# EAGLE schematic TSC8-75 (EAGLE 6.6.0)

## Sheet 1 of 4
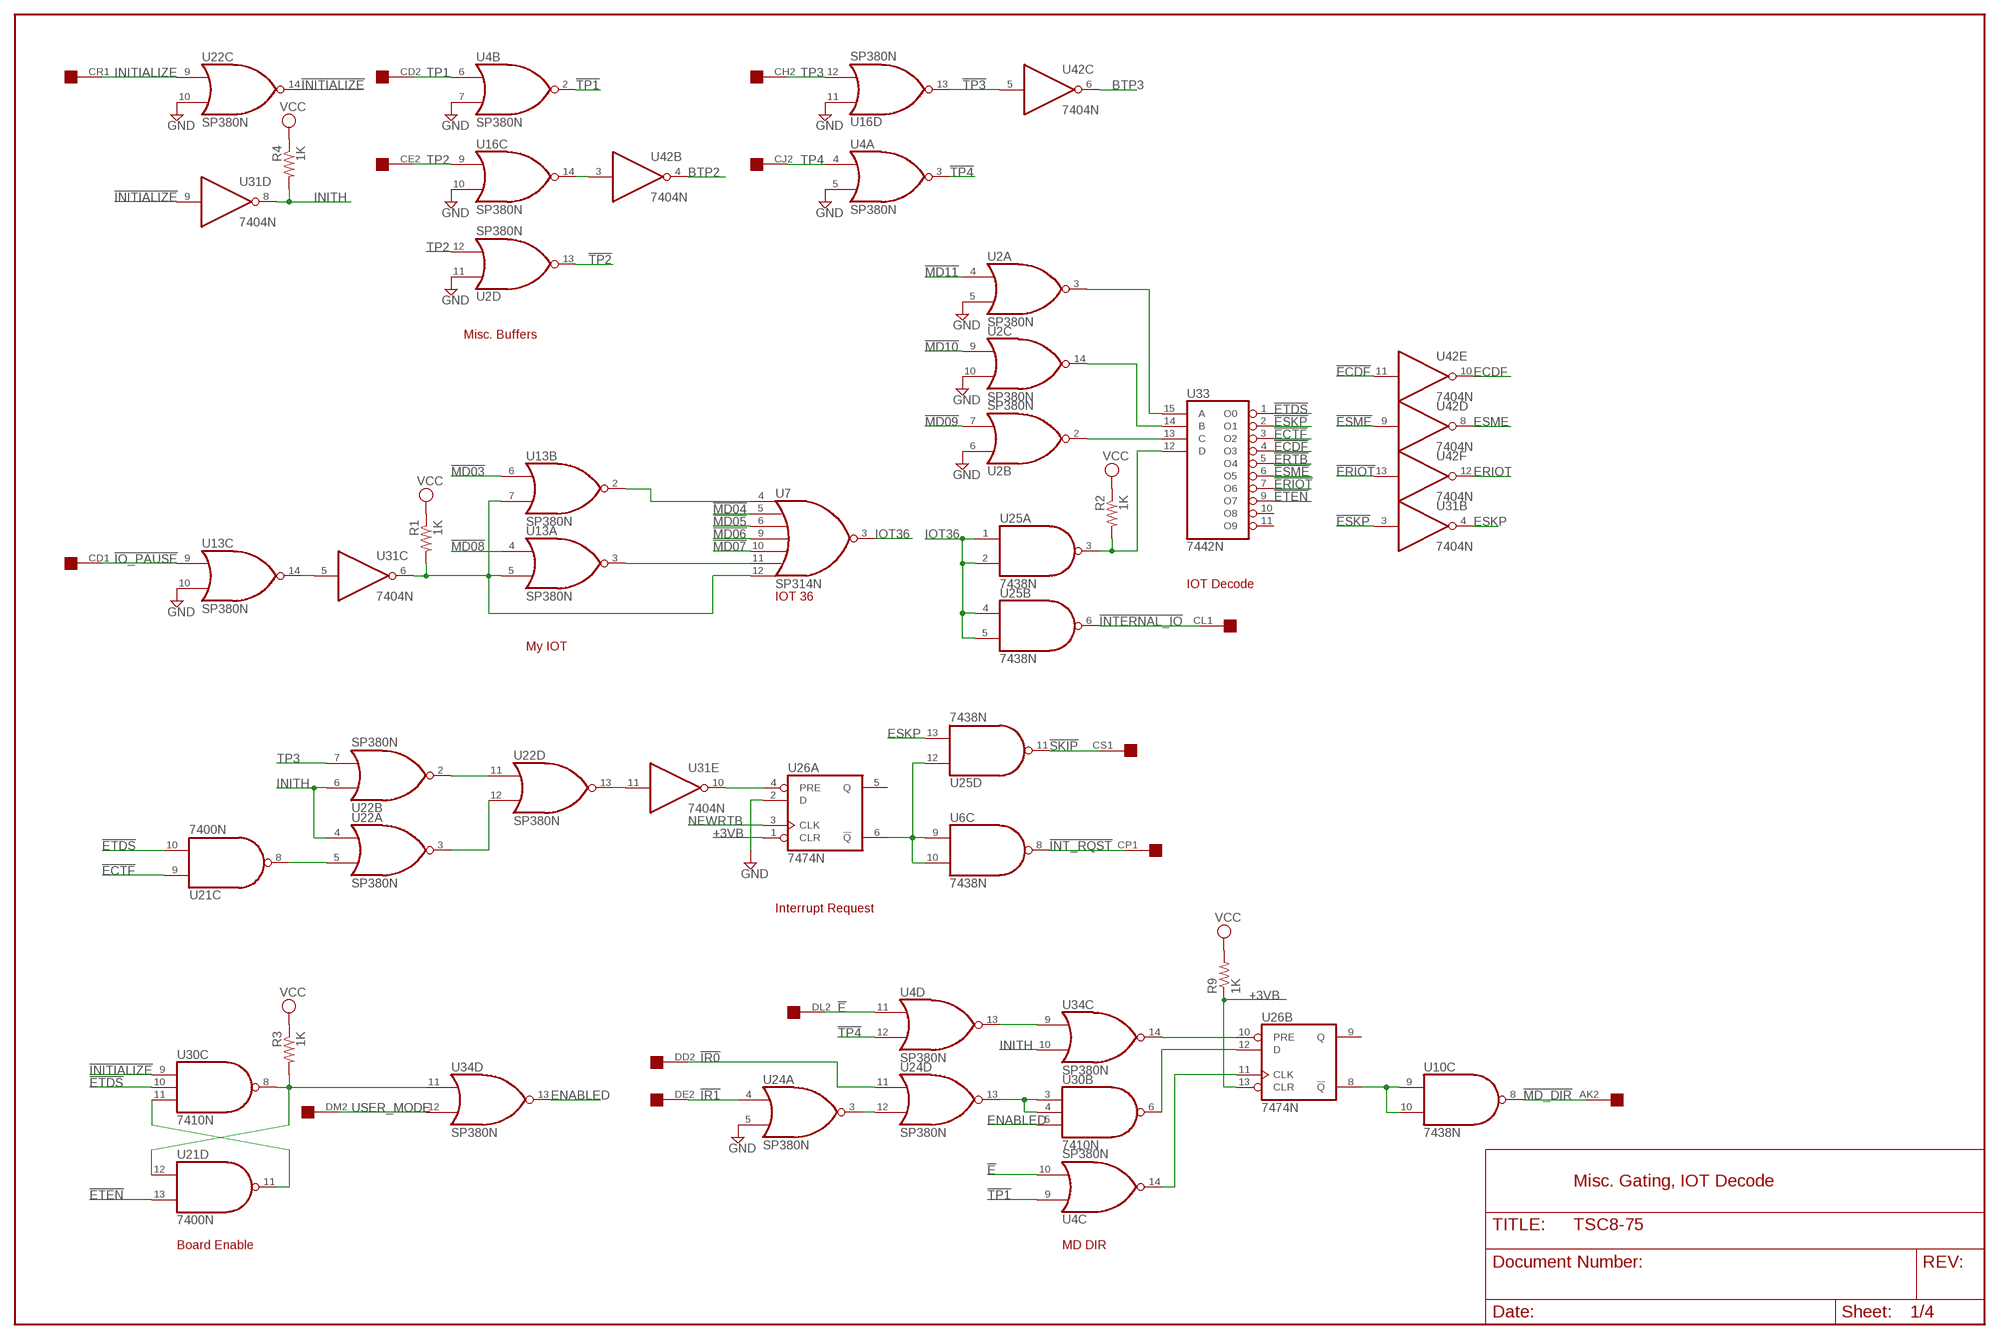
[diagram p0: schematic, sheet 1]

### Parts
EDGE  edge  QUAD  [EDGE-CON8]
R1  1K  R-US_0204/7  [0204/7]
R2  1K  R-US_0204/7  [0204/7]
R3  1K  R-US_0204/7  [0204/7]
R4  1K  R-US_0204/7  [0204/7]
R9  1K  R-US_0204/7  [0204/7]
U2  SP380N  [DIL14]
U4  SP380N  [DIL14]
U6  7438N  [DIL14]
U7  SP314N  [DIL14]
U10  7438N  [DIL14]
U13  SP380N  [DIL14]
U16  SP380N  [DIL14]
U21  7400N  [DIL14]
U22  SP380N  [DIL14]
U24  SP380N  [DIL14]
U25  7438N  [DIL14]
U26  7474N  74S74N  [DIL14]
U30  7410N  [DIL14]
U31  7404N  [DIL14]
U33  7442N  74LS42N  [DIL16]
U34  SP380N  [DIL14]
U42  7404N  [DIL14]

### Nets
!E: EDGE.DL2 U4.10(C:I1) U4.11(D:I0)
!ECDF: U33.4(O3) U42.11(E:I)
!ECTF: U21.9(C:I0) U33.3(O2)
!ERIOT: U33.7(O6) U42.13(F:I) ; also sheet 3
!ERTB: U33.5(O4) ; also sheet 3
!ESKP: U31.3(B:I) U33.2(O1)
!ESME: U33.6(O5) U42.9(D:I)
!ETDS: U21.10(C:I1) U30.10(C:I1) U33.1(O0) ; also sheet 4
!ETEN: U21.13(D:I1) U33.9(O7)
!INITIALIZE: U22.14(C:O) U30.9(C:I0) U31.9(D:I) ; also sheet 2,4
!INT_RQST: EDGE.CP1 U6.8(C:O)
!INTERNAL_IO: EDGE.CL1 U25.6(B:O)
!IO_PAUSE: EDGE.CD1 U13.9(C:I0)
!IR0: EDGE.DD2 U24.11(D:I0)
!IR1: EDGE.DE2 U24.4(A:I0)
!MD03: U13.6(B:I0) ; also sheet 2
!MD04: U7.5(I1) ; also sheet 2
!MD05: U7.6(I2) ; also sheet 2
!MD06: U7.9(I3) ; also sheet 2
!MD07: U7.10(I4) ; also sheet 2
!MD08: U13.4(A:I0) ; also sheet 2
!MD09: U2.7(B:I1) ; also sheet 2
!MD10: U2.9(C:I0) ; also sheet 2
!MD11: U2.4(A:I0) ; also sheet 2
!MD_DIR: EDGE.AK2 U10.8(C:O)
!SKIP: EDGE.CS1 U25.11(D:O) ; also sheet 4
!TP1: U4.2(B:O) U4.9(C:I0)
!TP2: U2.13(D:O) ; also sheet 2
!TP3: U16.13(D:O) U42.5(C:I)
!TP4: U4.3(A:O) U4.12(D:I1)
+3VB: R9.1 U26.1(A:CLR) U26.13(B:CLR) ; also sheet 4
BTP2: U42.4(B:O) ; also sheet 2
BTP3: U42.6(C:O) ; also sheet 4
ECDF: U42.10(E:O) ; also sheet 3,4
ENABLED: U30.5(B:I2) U34.13(D:O) ; also sheet 2
ERIOT: U42.12(F:O) ; also sheet 3
ESKP: U25.13(D:I1) U31.4(B:O)
ESME: U42.8(D:O) ; also sheet 4
GND: U2.5(A:I1) U2.6(B:I0) U2.10(C:I1) U2.11(D:I0) U4.5(A:I1) U4.7(B:I1) U13.10(C:I1) U16.10(C:I1) U16.11(D:I0) U22.10(C:I1) U24.5(A:I1) U26.2(A:D) ; also sheet 2,3,4
INITH: R4.2 U22.4(A:I0) U22.6(B:I0) U31.8(D:O) U34.10(C:I1)
INITIALIZE: EDGE.CR1 U22.9(C:I0)
IO_PAUSE: U13.14(C:O) U31.5(C:I)
IOT36: U7.3(O) U25.1(A:I0) U25.2(A:I1) U25.4(B:I0) U25.5(B:I1)
IR1: U24.3(A:O) U24.12(D:I1)
IRQ: U6.9(C:I0) U6.10(C:I1) U25.12(D:I0) U26.6(A:!Q)
MD09H: U2.2(B:O) U33.13(C)
MD10H: U2.14(C:O) U33.14(B)
MD11H: U2.3(A:O) U33.15(A)
N$21: U16.14(C:O) U42.3(B:I)
N$82: U4.14(C:O) U26.11(B:CLK)
N$91: U26.4(A:PRE) U31.10(E:O)
N$94: U26.12(B:D) U30.6(B:O)
N$97: U26.10(B:PRE) U34.14(C:O)
N$131: U7.4(I0) U13.2(B:O)
N$133: R1.2 U7.12(I6) U13.5(A:I1) U13.7(B:I1) U31.6(C:O)
N$136: U7.11(I5) U13.3(A:O)
N$160: R2.2 U25.3(A:O) U33.12(D)
N$161: R3.2 U21.12(D:I0) U30.8(C:O) U34.11(D:I0)
N$167: U4.13(D:O) U34.9(C:I0)
N$218: U24.13(D:O) U30.3(B:I0) U30.4(B:I1)
N$333: U22.2(B:O) U22.11(D:I0)
N$334: U22.3(A:O) U22.12(D:I1)
N$336: U21.8(C:O) U22.5(A:I1)
N$342: U22.13(D:O) U31.11(E:I)
N$406: U21.11(D:O) U30.11(C:I2)
N$516: U10.9(C:I0) U10.10(C:I1) U26.8(B:!Q)
NEWRTB: U26.3(A:CLK) ; also sheet 2
TP1: EDGE.CD2 U4.6(B:I0)
TP2: EDGE.CE2 U2.12(D:I1) U16.9(C:I0)
TP3: EDGE.CH2 U16.12(D:I1) U22.7(B:I1)
TP4: EDGE.CJ2 U4.4(A:I0)
USER_MODE: EDGE.DM2 U34.12(D:I1) ; also sheet 2
VCC: R1.1 R2.1 R3.1 R4.1 R9.2 ; also sheet 2,3,4
Unconnected: EDGE.AA1 EDGE.AB1 EDGE.AB2 EDGE.AC1 EDGE.AD2 EDGE.AE2 EDGE.AH2 EDGE.AJ2 EDGE.AL2 EDGE.AM2 EDGE.AP2 EDGE.AR2 EDGE.AS2 EDGE.AU2 EDGE.AV2 EDGE.BA1 EDGE.BB1 EDGE.BB2 EDGE.BD2 EDGE.BE2 EDGE.BH2 EDGE.BJ2 EDGE.BK2 EDGE.BL2 EDGE.BM2 EDGE.BP2 EDGE.BR2 EDGE.BS2 EDGE.BU2 EDGE.BV2 EDGE.CA1 EDGE.CB1 EDGE.CB2 EDGE.CJ1 EDGE.CK1 EDGE.CK2 EDGE.CL2 EDGE.CM1 EDGE.CM2 EDGE.CP2 EDGE.CR2 EDGE.CS2 EDGE.CU1 EDGE.CU2 EDGE.CV1 EDGE.CV2 EDGE.DA1 EDGE.DA2 EDGE.DB1 EDGE.DB2 EDGE.DH2 EDGE.DK2 EDGE.DP2 EDGE.DR2 EDGE.DS2 EDGE.DU2 EDGE.DV2 U6.11(D:O) U6.12(D:I0) U6.13(D:I1) U24.9(C:I0) U24.10(C:I1) U24.14(C:O) U26.5(A:Q) U26.9(B:Q) U31.1(A:I) U31.2(A:O) U33.10(O8) U33.11(O9) U34.3(A:O) U34.4(A:I0) U34.5(A:I1)

### Notes on the sheet
- Misc. Buffers
- IOT Decode
- IOT 36
- My IOT
- Interrupt Request
- Misc. Gating, IOT Decode
- Board Enable | MD DIR

## Sheet 2 of 4
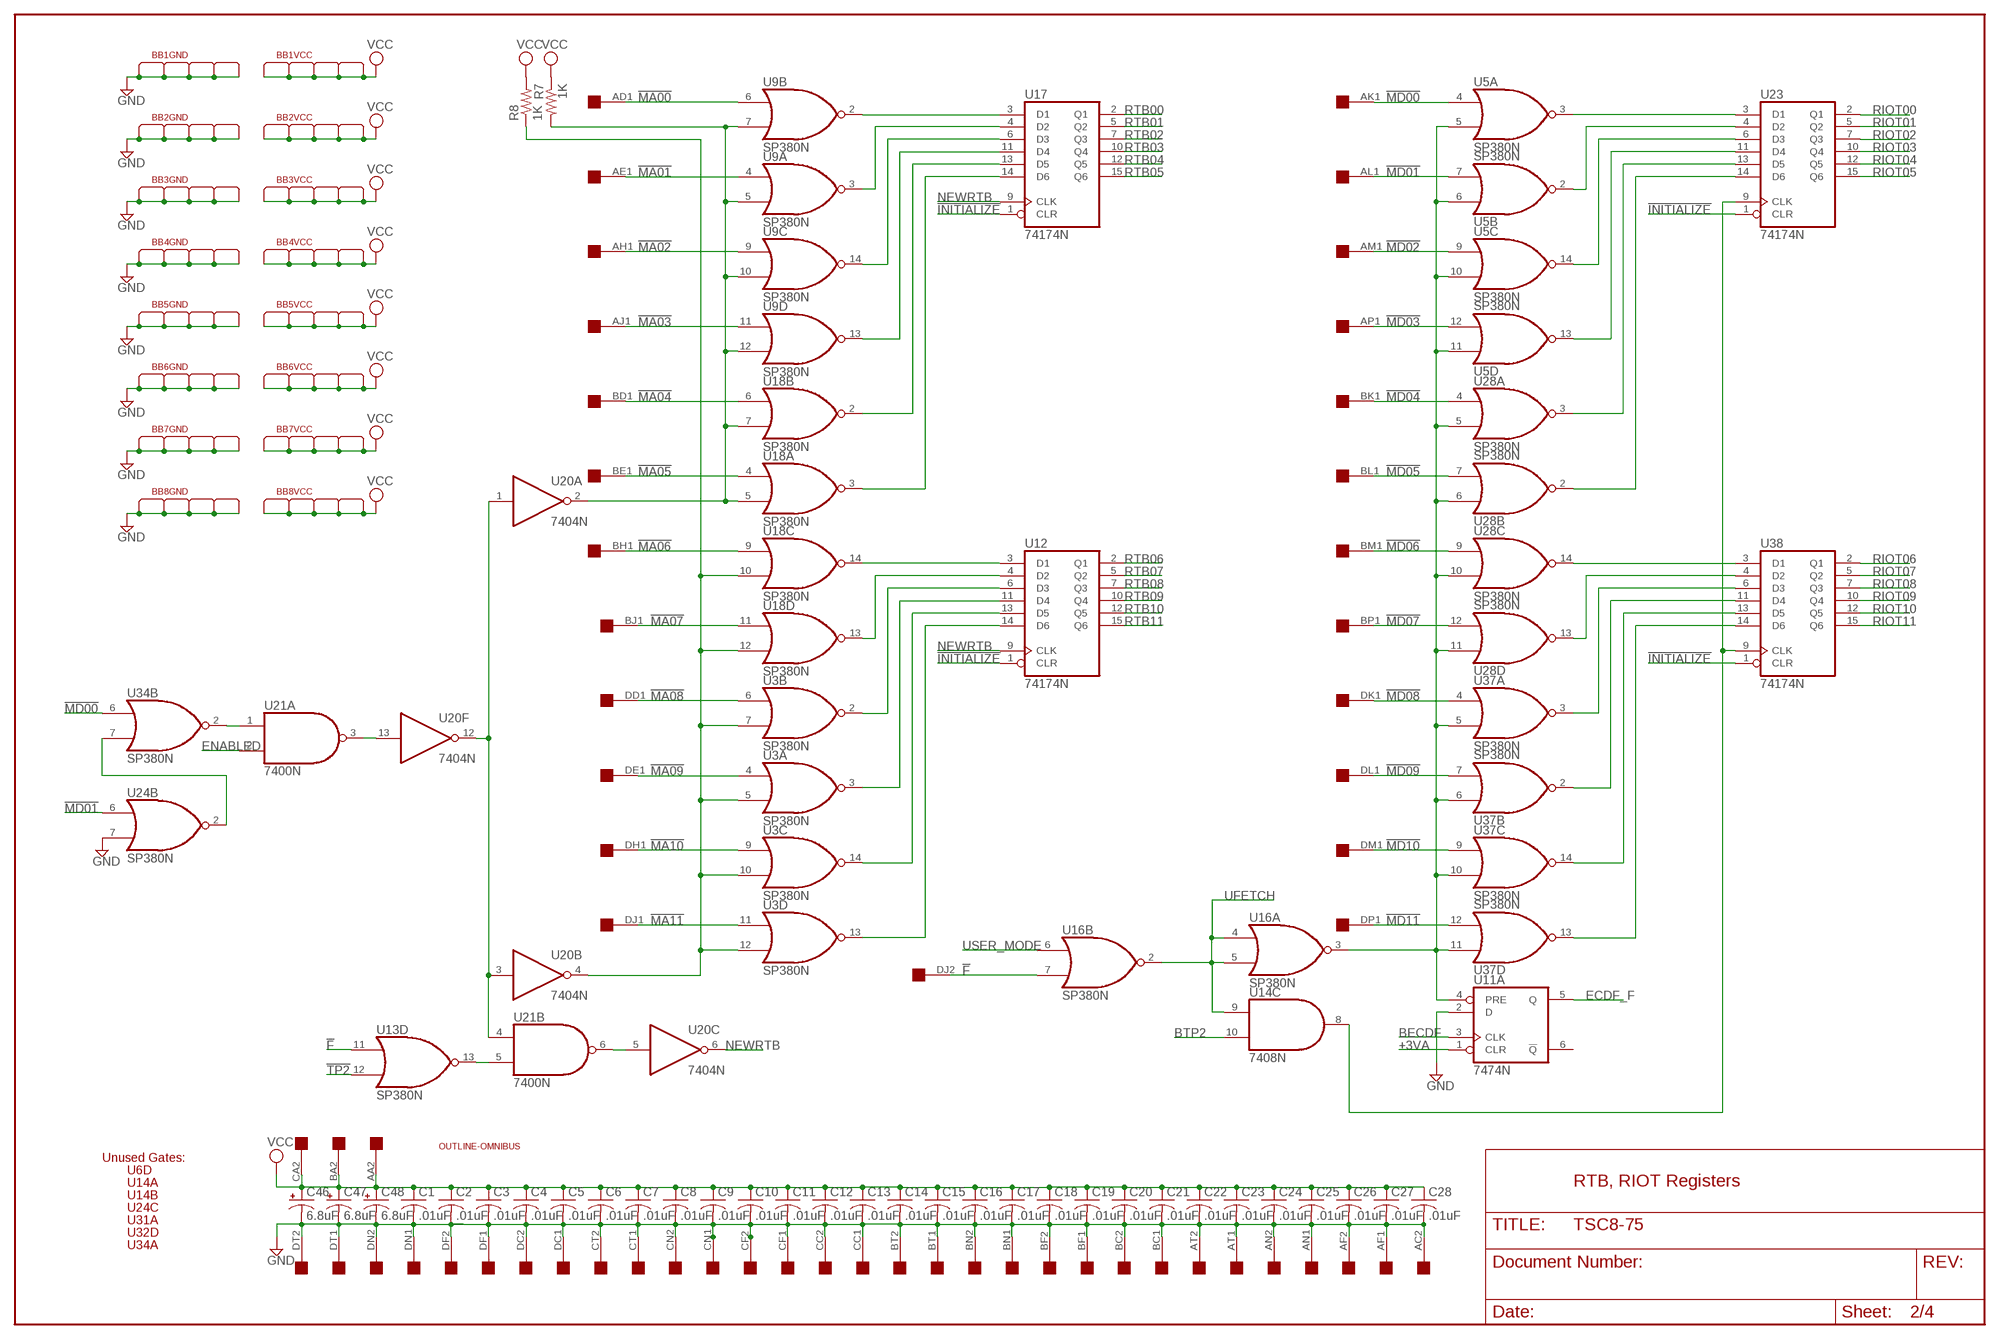
[diagram p1: schematic, sheet 2]

### Parts
BB1  BUSBAR  [BUSBAR]
BB2  BUSBAR  [BUSBAR]
BB3  BUSBAR  [BUSBAR]
BB4  BUSBAR  [BUSBAR]
BB5  BUSBAR  [BUSBAR]
BB6  BUSBAR  [BUSBAR]
BB7  BUSBAR  [BUSBAR]
BB8  BUSBAR  [BUSBAR]
C1  .01uF  C-US050-025X075  [C050-025X075]
C2  .01uF  C-US050-025X075  [C050-025X075]
C3  .01uF  C-US050-025X075  [C050-025X075]
C4  .01uF  C-US050-025X075  [C050-025X075]
C5  .01uF  C-US050-025X075  [C050-025X075]
C6  .01uF  C-US050-025X075  [C050-025X075]
C7  .01uF  C-US050-025X075  [C050-025X075]
C8  .01uF  C-US050-025X075  [C050-025X075]
C9  .01uF  C-US050-025X075  [C050-025X075]
C10  .01uF  C-US050-025X075  [C050-025X075]
C11  .01uF  C-US050-025X075  [C050-025X075]
C12  .01uF  C-US050-025X075  [C050-025X075]
C13  .01uF  C-US050-025X075  [C050-025X075]
C14  .01uF  C-US050-025X075  [C050-025X075]
C15  .01uF  C-US050-025X075  [C050-025X075]
C16  .01uF  C-US050-025X075  [C050-025X075]
C17  .01uF  C-US050-025X075  [C050-025X075]
C18  .01uF  C-US050-025X075  [C050-025X075]
C19  .01uF  C-US050-025X075  [C050-025X075]
C20  .01uF  C-US050-025X075  [C050-025X075]
C21  .01uF  C-US050-025X075  [C050-025X075]
C22  .01uF  C-US050-025X075  [C050-025X075]
C23  .01uF  C-US050-025X075  [C050-025X075]
C24  .01uF  C-US050-025X075  [C050-025X075]
C25  .01uF  C-US050-025X075  [C050-025X075]
C26  .01uF  C-US050-025X075  [C050-025X075]
C27  .01uF  C-US050-025X075  [C050-025X075]
C28  .01uF  C-US050-025X075  [C050-025X075]
C46  6.8uF  CPOL-USE20-8AXIAL  [E12-8]
C47  6.8uF  CPOL-USE20-8AXIAL  [E12-8]
C48  6.8uF  CPOL-USE20-8AXIAL  [E12-8]
R7  1K  R-US_0204/7  [0204/7]
R8  1K  R-US_0204/7  [0204/7]
U3  SP380N  [DIL14]
U5  SP380N  [DIL14]
U9  SP380N  [DIL14]
U11  7474N  74S74N  [DIL14]
U12  74174N  [DIL16]
U14  7408N  74S08N  [DIL14]
U17  74174N  [DIL16]
U18  SP380N  [DIL14]
U20  7404N  [DIL14]
U23  74174N  [DIL16]
U28  SP380N  [DIL14]
U37  SP380N  [DIL14]
U38  74174N  [DIL16]
U$1  OUTLINE-OMNIBUS  [OMNIBUS]

### Nets
!F: EDGE.DJ2 U13.11(D:I0) U16.7(B:I1)
!INITIALIZE: U12.1(CLR) U17.1(CLR) U23.1(CLR) U38.1(CLR) ; also sheet 1,4
!MA00: EDGE.AD1 U9.6(B:I0)
!MA01: EDGE.AE1 U9.4(A:I0)
!MA02: EDGE.AH1 U9.9(C:I0)
!MA03: EDGE.AJ1 U9.11(D:I0)
!MA04: EDGE.BD1 U18.6(B:I0)
!MA05: EDGE.BE1 U18.4(A:I0)
!MA06: EDGE.BH1 U18.9(C:I0)
!MA07: EDGE.BJ1 U18.11(D:I0)
!MA08: EDGE.DD1 U3.6(B:I0)
!MA09: EDGE.DE1 U3.4(A:I0)
!MA10: EDGE.DH1 U3.9(C:I0)
!MA11: EDGE.DJ1 U3.11(D:I0)
!MD00: EDGE.AK1 U5.4(A:I0) U34.6(B:I0)
!MD01: EDGE.AL1 U5.7(B:I1) U24.6(B:I0)
!MD02: EDGE.AM1 U5.9(C:I0)
!MD03: EDGE.AP1 U5.12(D:I1) ; also sheet 1
!MD04: EDGE.BK1 U28.4(A:I0) ; also sheet 1
!MD05: EDGE.BL1 U28.7(B:I1) ; also sheet 1
!MD06: EDGE.BM1 U28.9(C:I0) ; also sheet 1
!MD07: EDGE.BP1 U28.12(D:I1) ; also sheet 1
!MD08: EDGE.DK1 U37.4(A:I0) ; also sheet 1
!MD09: EDGE.DL1 U37.7(B:I1) ; also sheet 1
!MD10: EDGE.DM1 U37.9(C:I0) ; also sheet 1
!MD11: EDGE.DP1 U37.12(D:I1) ; also sheet 1
!TP2: U13.12(D:I1) ; also sheet 1
+3VA: U11.1(A:CLR) ; also sheet 4
BECDF: U11.3(A:CLK) ; also sheet 3
BTP2: U14.10(C:I1) ; also sheet 1
ECDF_F: U11.5(A:Q) ; also sheet 4
ENABLED: U21.2(A:I1) ; also sheet 1
GND: BB1.GND1 BB1.GND2 BB1.GND3 BB1.GND4 BB1.GND5 BB2.GND1 BB2.GND2 BB2.GND3 BB2.GND4 BB2.GND5 BB3.GND1 BB3.GND2 BB3.GND3 BB3.GND4 BB3.GND5 BB4.GND1 BB4.GND2 BB4.GND3 BB4.GND4 BB4.GND5 BB5.GND1 BB5.GND2 BB5.GND3 BB5.GND4 BB5.GND5 BB6.GND1 BB6.GND2 BB6.GND3 BB6.GND4 BB6.GND5 BB7.GND1 BB7.GND2 BB7.GND3 BB7.GND4 BB7.GND5 BB8.GND1 BB8.GND2 BB8.GND3 BB8.GND4 BB8.GND5 C1.2 C2.2 C3.2 C4.2 C5.2 C6.2 C7.2 C8.2 C9.2 C10.2 C11.2 C12.2 C13.2 C14.2 C15.2 C16.2 C17.2 C18.2 C19.2 C20.2 C21.2 C22.2 C23.2 C24.2 C25.2 C26.2 C27.2 C28.2 C46.- C47.- C48.- EDGE.AC2 EDGE.AF1 EDGE.AF2 EDGE.AN1 EDGE.AN2 EDGE.AT1 EDGE.AT2 EDGE.BC1 EDGE.BC2 EDGE.BF1 EDGE.BF2 EDGE.BN1 EDGE.BN2 EDGE.BT1 EDGE.BT2 EDGE.CC1 EDGE.CC2 EDGE.CF1 EDGE.CF2 EDGE.CN1 EDGE.CN2 EDGE.CT1 EDGE.CT2 EDGE.DC1 EDGE.DC2 EDGE.DF1 EDGE.DF2 EDGE.DN1 EDGE.DN2 EDGE.DT1 EDGE.DT2 U11.2(A:D) U24.7(B:I1) ; also sheet 1,3,4
MD01H: U24.2(B:O) U34.7(B:I1)
N$1: U20.5(C:I) U21.6(B:O)
N$2: U9.3(A:O) U17.4(D2)
N$4: R7.2 U9.5(A:I1) U9.7(B:I1) U9.10(C:I1) U9.12(D:I1) U18.5(A:I1) U18.7(B:I1) U20.2(A:O)
N$10: U9.13(D:O) U17.11(D4)
N$11: U9.14(C:O) U17.6(D3)
N$12: U9.2(B:O) U17.3(D1)
N$14: U17.13(D5) U18.2(B:O)
N$20: R8.1 U3.5(A:I1) U3.7(B:I1) U3.10(C:I1) U3.12(D:I1) U18.10(C:I1) U18.12(D:I1) U20.4(B:O)
N$22: U12.4(D2) U18.13(D:O)
N$23: U12.3(D1) U18.14(C:O)
N$24: U17.14(D6) U18.3(A:O)
N$109: U37.3(A:O) U38.6(D3)
N$172: U21.1(A:I0) U34.2(B:O)
N$212: U14.8(C:O) U23.9(CLK) U38.9(CLK)
N$248: U5.3(A:O) U23.3(D1)
N$250: U5.5(A:I1) U5.6(B:I0) U5.10(C:I1) U5.11(D:I0) U11.4(A:PRE) U16.3(A:O) U28.5(A:I1) U28.6(B:I0) U28.10(C:I1) U28.11(D:I0) U37.5(A:I1) U37.6(B:I0) U37.10(C:I1) U37.11(D:I0)
N$256: U5.13(D:O) U23.11(D4)
N$257: U5.14(C:O) U23.6(D3)
N$258: U5.2(B:O) U23.4(D2)
N$274: U23.14(D6) U28.2(B:O)
N$275: U23.13(D5) U28.3(A:O)
N$330: U13.13(D:O) U21.5(B:I1)
N$372: U3.3(A:O) U12.11(D4)
N$380: U3.13(D:O) U12.14(D6)
N$381: U3.14(C:O) U12.13(D5)
N$382: U3.2(B:O) U12.6(D3)
N$401: U20.1(A:I) U20.3(B:I) U20.12(F:O) U21.4(B:I0)
N$408: U20.13(F:I) U21.3(A:O)
N$483: U28.14(C:O) U38.3(D1)
N$486: U37.13(D:O) U38.14(D6)
N$487: U37.14(C:O) U38.13(D5)
N$488: U37.2(B:O) U38.11(D4)
N$490: U28.13(D:O) U38.4(D2)
NEWRTB: U12.9(CLK) U17.9(CLK) U20.6(C:O) ; also sheet 1
RIOT00: U23.2(Q1) ; also sheet 3,4
RIOT01: U23.5(Q2) ; also sheet 3,4
RIOT02: U23.7(Q3) ; also sheet 3,4
RIOT03: U23.10(Q4) ; also sheet 3,4
RIOT04: U23.12(Q5) ; also sheet 3,4
RIOT05: U23.15(Q6) ; also sheet 3,4
RIOT06: U38.2(Q1) ; also sheet 3,4
RIOT07: U38.5(Q2) ; also sheet 3,4
RIOT08: U38.7(Q3) ; also sheet 3,4
RIOT09: U38.10(Q4) ; also sheet 3,4
RIOT10: U38.12(Q5) ; also sheet 3,4
RIOT11: U38.15(Q6) ; also sheet 3,4
RTB00: U17.2(Q1) ; also sheet 3
RTB01: U17.5(Q2) ; also sheet 3
RTB02: U17.7(Q3) ; also sheet 3
RTB03: U17.10(Q4) ; also sheet 3
RTB04: U17.12(Q5) ; also sheet 3
RTB05: U17.15(Q6) ; also sheet 3
RTB06: U12.2(Q1) ; also sheet 3
RTB07: U12.5(Q2) ; also sheet 3
RTB08: U12.7(Q3) ; also sheet 3
RTB09: U12.10(Q4) ; also sheet 3
RTB10: U12.12(Q5) ; also sheet 3
RTB11: U12.15(Q6) ; also sheet 3
UFETCH: U14.9(C:I0) U16.2(B:O) U16.4(A:I0) U16.5(A:I1) ; also sheet 4
USER_MODE: U16.6(B:I0) ; also sheet 1
VCC: BB1.VCC1 BB1.VCC2 BB1.VCC3 BB1.VCC4 BB1.VCC5 BB2.VCC1 BB2.VCC2 BB2.VCC3 BB2.VCC4 BB2.VCC5 BB3.VCC1 BB3.VCC2 BB3.VCC3 BB3.VCC4 BB3.VCC5 BB4.VCC1 BB4.VCC2 BB4.VCC3 BB4.VCC4 BB4.VCC5 BB5.VCC1 BB5.VCC2 BB5.VCC3 BB5.VCC4 BB5.VCC5 BB6.VCC1 BB6.VCC2 BB6.VCC3 BB6.VCC4 BB6.VCC5 BB7.VCC1 BB7.VCC2 BB7.VCC3 BB7.VCC4 BB7.VCC5 BB8.VCC1 BB8.VCC2 BB8.VCC3 BB8.VCC4 BB8.VCC5 C1.1 C2.1 C3.1 C4.1 C5.1 C6.1 C7.1 C8.1 C9.1 C10.1 C11.1 C12.1 C13.1 C14.1 C15.1 C16.1 C17.1 C18.1 C19.1 C20.1 C21.1 C22.1 C23.1 C24.1 C25.1 C26.1 C27.1 C28.1 C46.+ C47.+ C48.+ EDGE.AA2 EDGE.BA2 EDGE.CA2 R7.1 R8.2 ; also sheet 1,3,4
Unconnected: U11.6(A:!Q) U14.1(A:I0) U14.2(A:I1) U14.3(A:O) U14.4(B:I0) U14.5(B:I1) U14.6(B:O)

### Notes on the sheet
- Unused Gates:
- U6D
- U14A | RTB, RIOT Registers
- U14B
- U24C
- U31A
- U32D
- U34A

## Sheet 3 of 4
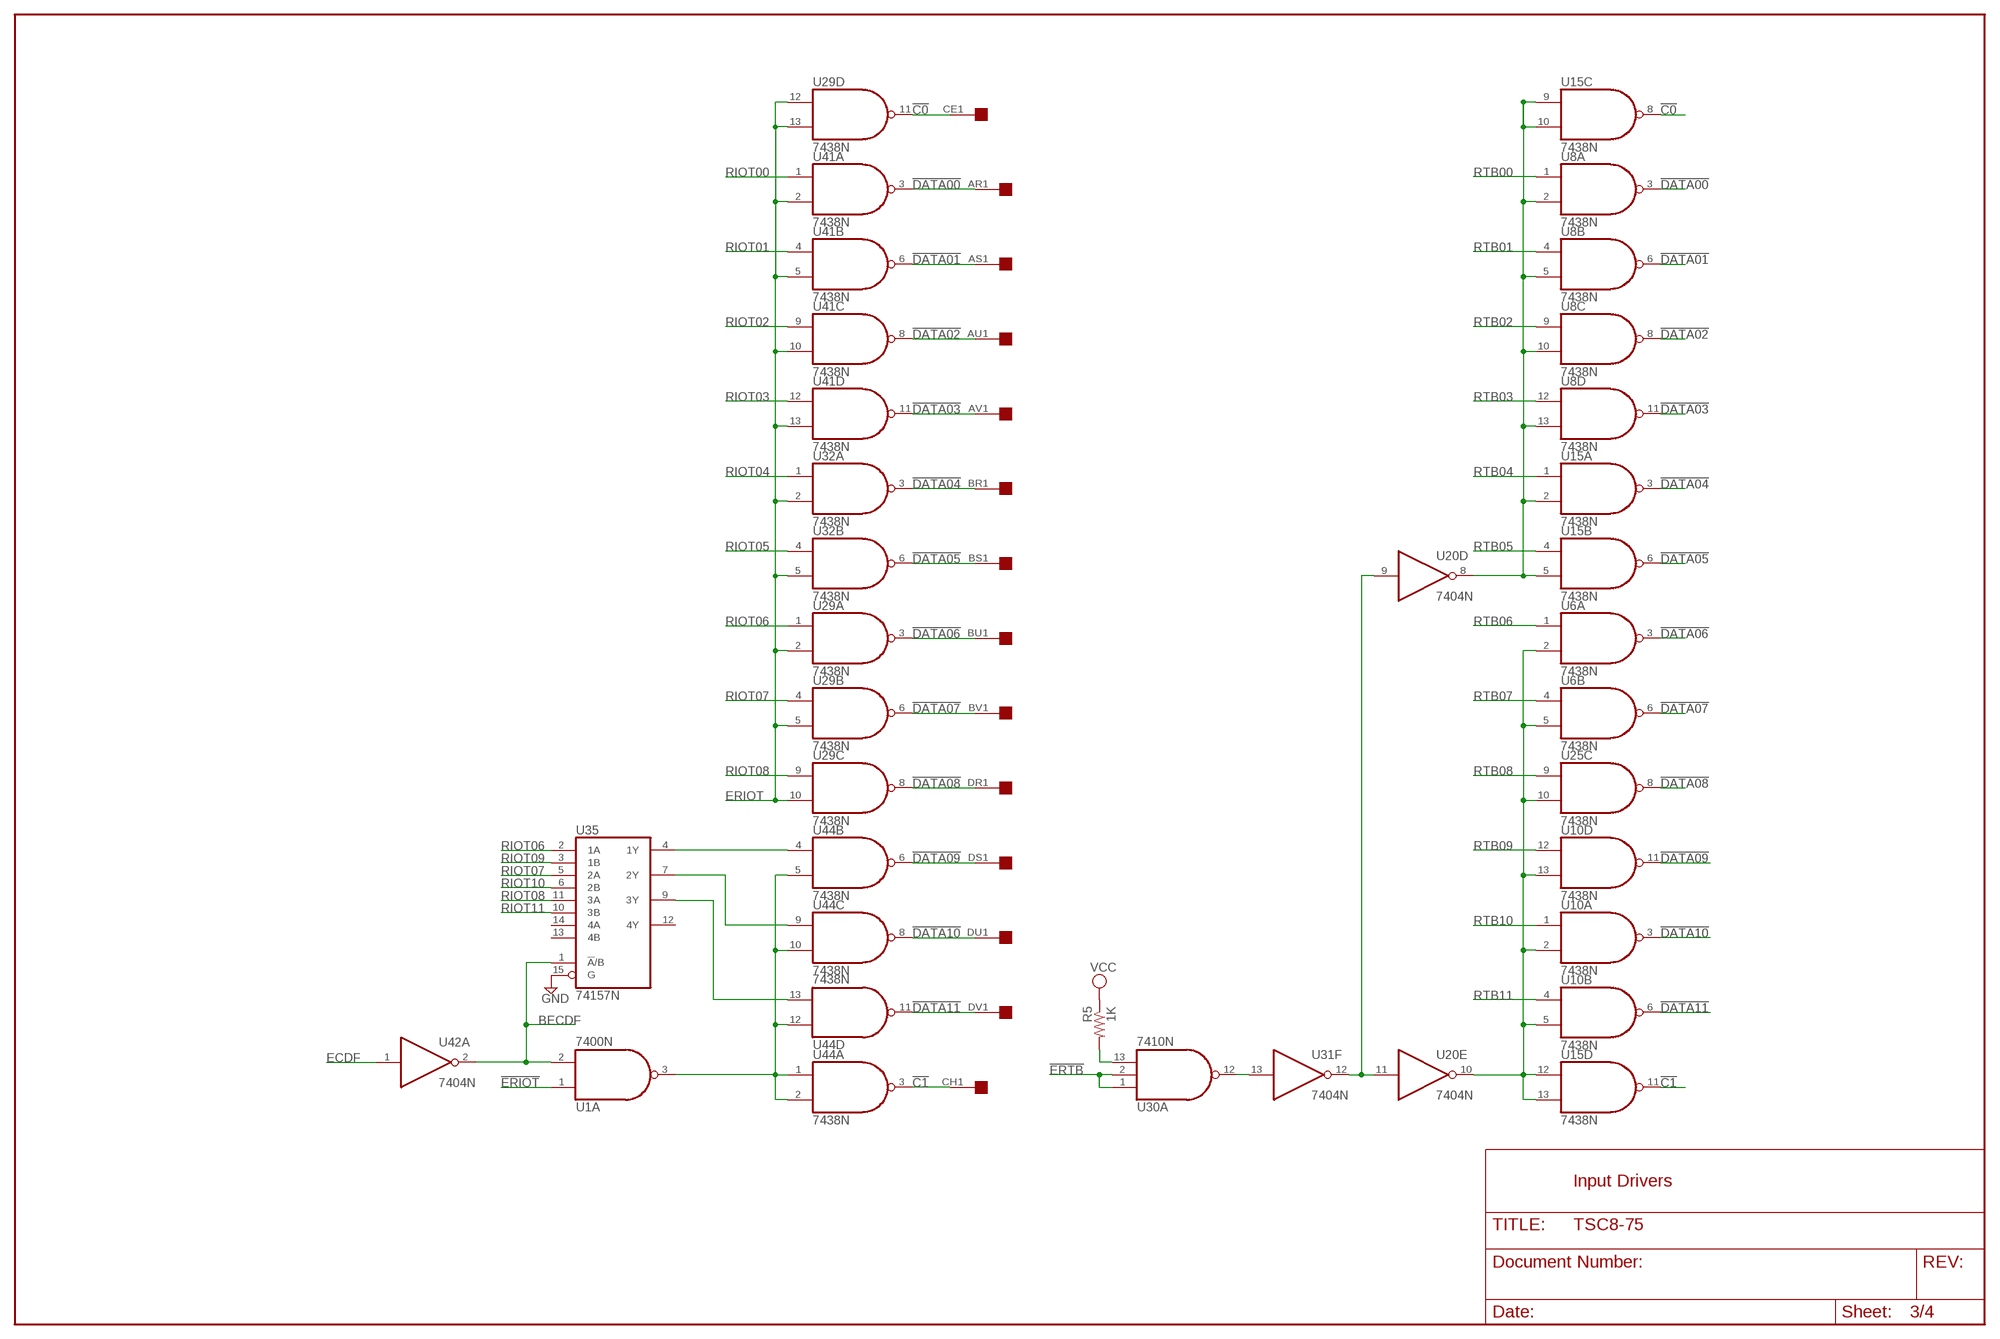
[diagram p2: schematic, sheet 3]

### Parts
R5  1K  R-US_0204/7  [0204/7]
U1  7400N  [DIL14]
U8  7438N  [DIL14]
U15  7438N  [DIL14]
U29  7438N  [DIL14]
U32  7438N  [DIL14]
U35  74157N  [DIL16]
U41  7438N  [DIL14]
U44  7438N  [DIL14]

### Nets
!C0: EDGE.CE1 U15.8(C:O) U29.11(D:O)
!C1: EDGE.CH1 U15.11(D:O) U44.3(A:O)
!DATA00: EDGE.AR1 U8.3(A:O) U41.3(A:O)
!DATA01: EDGE.AS1 U8.6(B:O) U41.6(B:O)
!DATA02: EDGE.AU1 U8.8(C:O) U41.8(C:O)
!DATA03: EDGE.AV1 U8.11(D:O) U41.11(D:O)
!DATA04: EDGE.BR1 U15.3(A:O) U32.3(A:O)
!DATA05: EDGE.BS1 U15.6(B:O) U32.6(B:O)
!DATA06: EDGE.BU1 U6.3(A:O) U29.3(A:O)
!DATA07: EDGE.BV1 U6.6(B:O) U29.6(B:O)
!DATA08: EDGE.DR1 U25.8(C:O) U29.8(C:O)
!DATA09: EDGE.DS1 U10.11(D:O) U44.6(B:O)
!DATA10: EDGE.DU1 U10.3(A:O) U44.8(C:O)
!DATA11: EDGE.DV1 U10.6(B:O) U44.11(D:O)
!ERIOT: U1.1(A:I0) ; also sheet 1
!ERTB: U30.1(A:I0) U30.2(A:I1) ; also sheet 1
BECDF: U1.2(A:I1) U35.1(!A!/B) U42.2(A:O) ; also sheet 2
ECDF: U42.1(A:I) ; also sheet 1,4
ERIOT: U29.2(A:I1) U29.5(B:I1) U29.10(C:I1) U29.12(D:I0) U29.13(D:I1) U32.2(A:I1) U32.5(B:I1) U41.2(A:I1) U41.5(B:I1) U41.10(C:I1) U41.13(D:I1) ; also sheet 1
GND: U35.15(G) ; also sheet 1,2,4
N$18: U8.2(A:I1) U8.5(B:I1) U8.10(C:I1) U8.13(D:I1) U15.2(A:I1) U15.5(B:I1) U15.9(C:I0) U15.10(C:I1) U20.8(D:O)
N$104: U35.4(1Y) U44.4(B:I0)
N$115: U35.9(3Y) U44.13(D:I1)
N$116: U35.7(2Y) U44.9(C:I0)
N$117: U1.3(A:O) U44.1(A:I0) U44.2(A:I1) U44.5(B:I1) U44.10(C:I1) U44.12(D:I0)
N$139: U6.2(A:I1) U6.5(B:I1) U10.2(A:I1) U10.5(B:I1) U10.13(D:I1) U15.12(D:I0) U15.13(D:I1) U20.10(E:O) U25.10(C:I1)
N$350: U30.12(A:O) U31.13(F:I)
N$356: U20.9(D:I) U20.11(E:I) U31.12(F:O)
N$413: R5.2 U30.13(A:I2)
RIOT00: U41.1(A:I0) ; also sheet 2,4
RIOT01: U41.4(B:I0) ; also sheet 2,4
RIOT02: U41.9(C:I0) ; also sheet 2,4
RIOT03: U41.12(D:I0) ; also sheet 2,4
RIOT04: U32.1(A:I0) ; also sheet 2,4
RIOT05: U32.4(B:I0) ; also sheet 2,4
RIOT06: U29.1(A:I0) U35.2(1A) ; also sheet 2,4
RIOT07: U29.4(B:I0) U35.5(2A) ; also sheet 2,4
RIOT08: U29.9(C:I0) U35.11(3A) ; also sheet 2,4
RIOT09: U35.3(1B) ; also sheet 2,4
RIOT10: U35.6(2B) ; also sheet 2,4
RIOT11: U35.10(3B) ; also sheet 2,4
RTB00: U8.1(A:I0) ; also sheet 2
RTB01: U8.4(B:I0) ; also sheet 2
RTB02: U8.9(C:I0) ; also sheet 2
RTB03: U8.12(D:I0) ; also sheet 2
RTB04: U15.1(A:I0) ; also sheet 2
RTB05: U15.4(B:I0) ; also sheet 2
RTB06: U6.1(A:I0) ; also sheet 2
RTB07: U6.4(B:I0) ; also sheet 2
RTB08: U25.9(C:I0) ; also sheet 2
RTB09: U10.12(D:I0) ; also sheet 2
RTB10: U10.1(A:I0) ; also sheet 2
RTB11: U10.4(B:I0) ; also sheet 2
VCC: R5.1 ; also sheet 1,2,4
Unconnected: U32.11(D:O) U32.12(D:I0) U32.13(D:I1) U35.12(4Y) U35.13(4B) U35.14(4A)

### Notes on the sheet
- Input Drivers

## Sheet 4 of 4
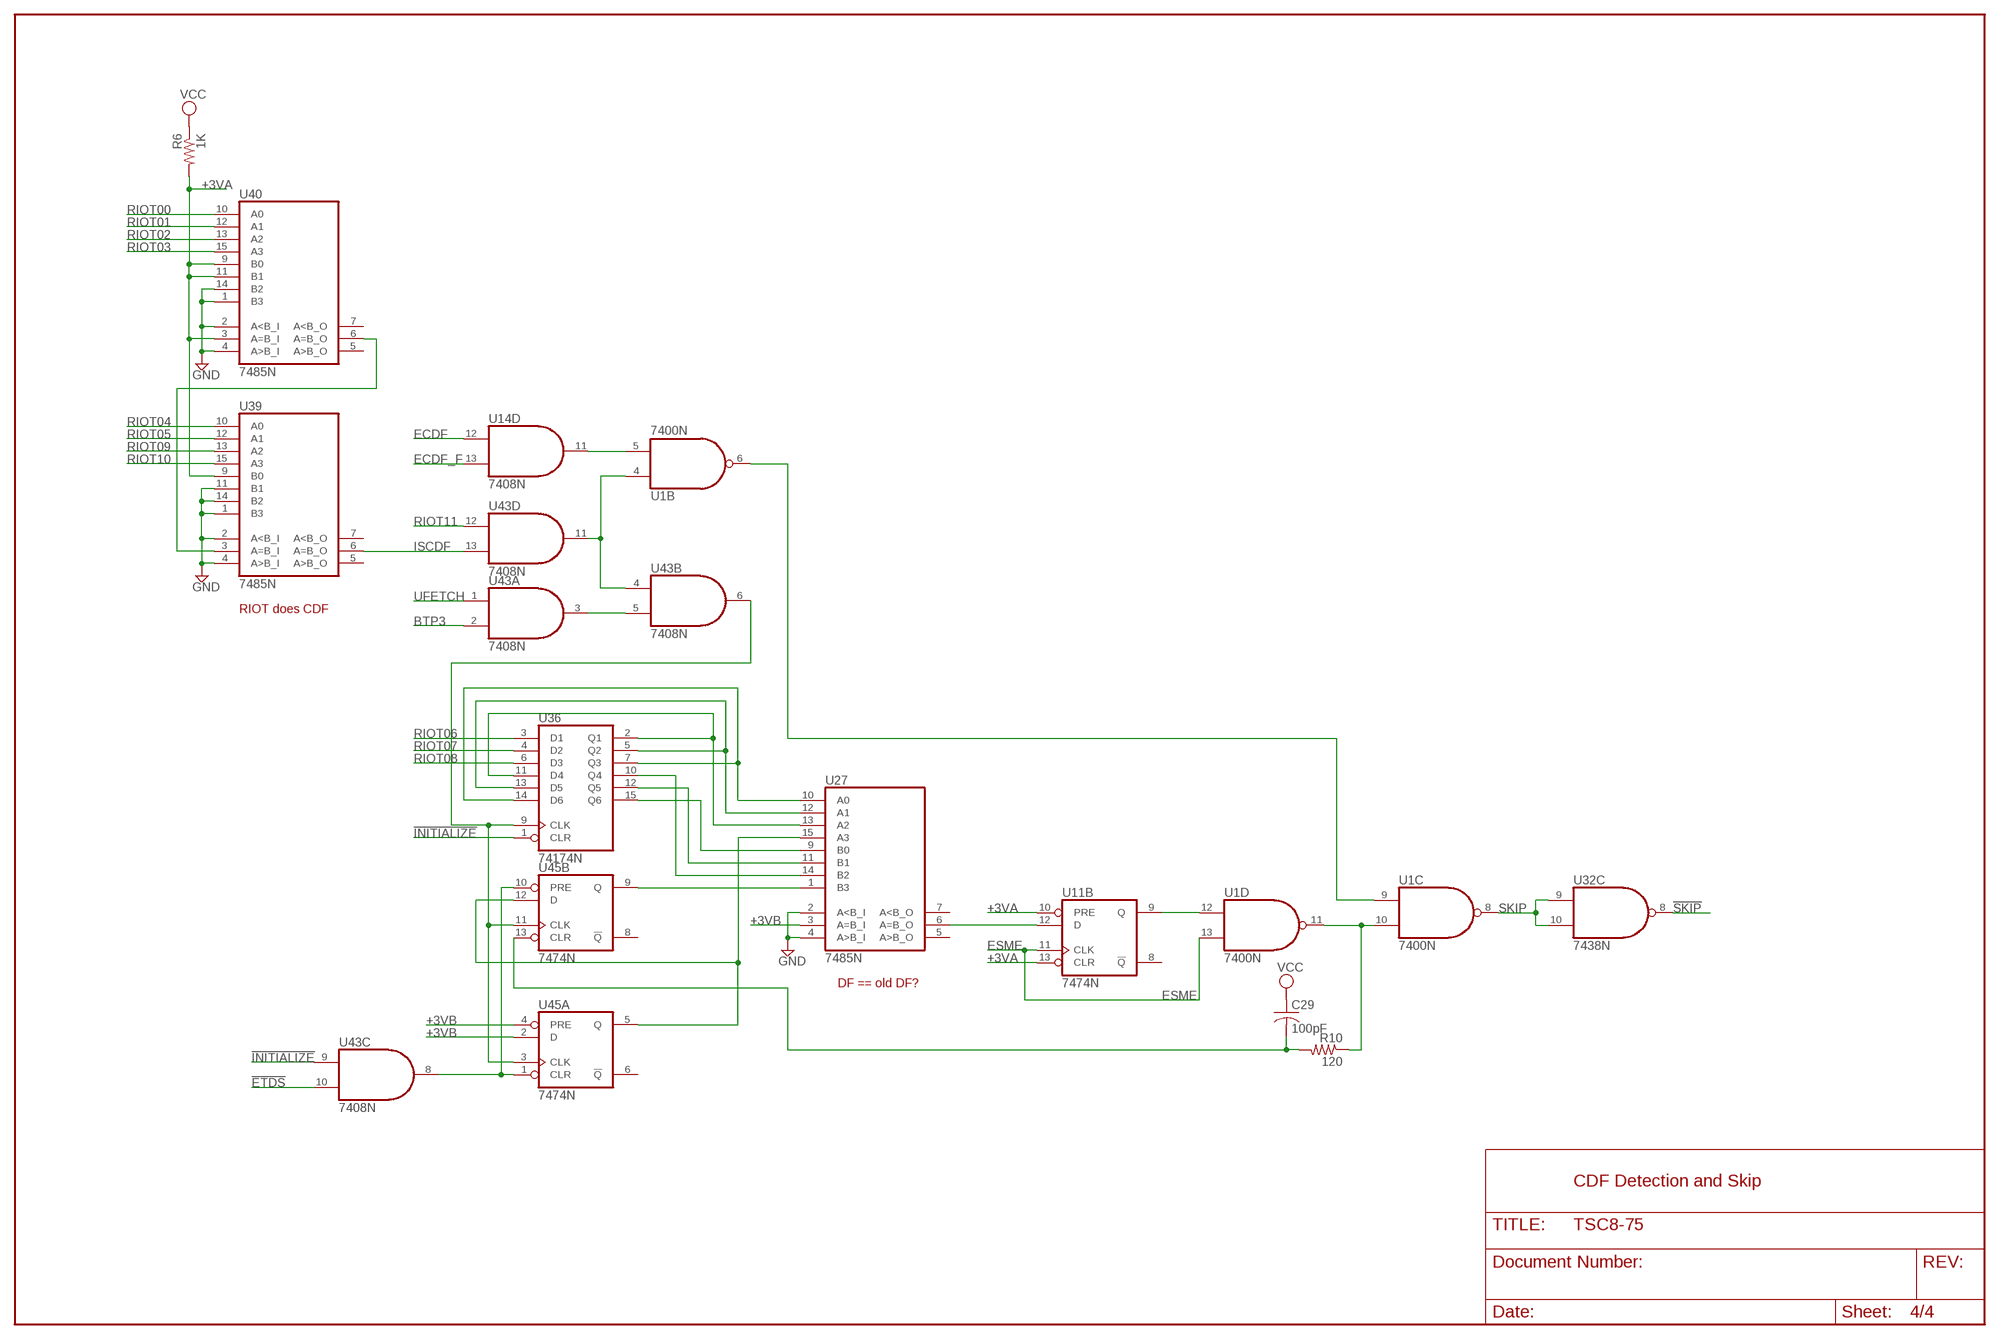
[diagram p3: schematic, sheet 4]

### Parts
C29  100pF  C-US050-025X075  [C050-025X075]
R6  1K  R-US_0204/7  [0204/7]
R10  120  R-US_0204/7  [0204/7]
U27  7485N  [DIL16]
U36  74174N  [DIL16]
U39  7485N  [DIL16]
U40  7485N  [DIL16]
U43  7408N  74S08N  [DIL14]
U45  7474N  74S74N  [DIL14]

### Nets
!ETDS: U43.10(C:I1) ; also sheet 1
!INITIALIZE: U36.1(CLR) U43.9(C:I0) ; also sheet 1,2
!SKIP: U32.8(C:O) ; also sheet 1
+3VA: R6.2 U11.10(B:PRE) U11.13(B:CLR) U39.9(B0) U40.3(A=B_I) U40.9(B0) U40.11(B1) ; also sheet 2
+3VB: U27.3(A=B_I) U45.2(A:D) U45.4(A:PRE) ; also sheet 1
BTP3: U43.2(A:I1) ; also sheet 1
ECDF: U14.12(D:I0) ; also sheet 1,3
ECDF_F: U14.13(D:I1) ; also sheet 2
ESME: U1.13(D:I1) U11.11(B:CLK) ; also sheet 1
GND: U27.2(A<B_I) U27.4(A>B_I) U39.1(B3) U39.2(A<B_I) U39.4(A>B_I) U39.11(B1) U39.14(B2) U40.1(B3) U40.2(A<B_I) U40.4(A>B_I) U40.14(B2) ; also sheet 1,2,3
ISCDF: U39.6(A=B_O) U43.13(D:I1)
N$3: U1.5(B:I1) U14.11(D:O)
N$5: U11.12(B:D) U27.6(A=B_O)
N$25: U27.10(A0) U36.7(Q3) U36.14(D6)
N$30: U27.1(B3) U45.9(B:Q)
N$31: U27.14(B2) U36.10(Q4)
N$32: U27.11(B1) U36.12(Q5)
N$33: U27.9(B0) U36.15(Q6)
N$34: U27.15(A3) U45.5(A:Q) U45.12(B:D)
N$35: U27.13(A2) U36.2(Q1) U36.11(D4)
N$36: U27.12(A1) U36.5(Q2) U36.13(D5)
N$40: U36.9(CLK) U43.6(B:O) U45.3(A:CLK) U45.11(B:CLK)
N$49: C29.2 R10.2 U45.13(B:CLR)
N$57: U43.8(C:O) U45.1(A:CLR) U45.10(B:PRE)
N$63: R10.1 U1.10(C:I1) U1.11(D:O)
N$177: U1.4(B:I0) U43.4(B:I0) U43.11(D:O)
N$178: U43.3(A:O) U43.5(B:I1)
N$358: U39.3(A=B_I) U40.6(A=B_O)
N$457: U1.12(D:I0) U11.9(B:Q)
N$498: U1.6(B:O) U1.9(C:I0)
RIOT00: U40.10(A0) ; also sheet 2,3
RIOT01: U40.12(A1) ; also sheet 2,3
RIOT02: U40.13(A2) ; also sheet 2,3
RIOT03: U40.15(A3) ; also sheet 2,3
RIOT04: U39.10(A0) ; also sheet 2,3
RIOT05: U39.12(A1) ; also sheet 2,3
RIOT06: U36.3(D1) ; also sheet 2,3
RIOT07: U36.4(D2) ; also sheet 2,3
RIOT08: U36.6(D3) ; also sheet 2,3
RIOT09: U39.13(A2) ; also sheet 2,3
RIOT10: U39.15(A3) ; also sheet 2,3
RIOT11: U43.12(D:I0) ; also sheet 2,3
SKIP: U1.8(C:O) U32.9(C:I0) U32.10(C:I1)
UFETCH: U43.1(A:I0) ; also sheet 2
VCC: C29.1 R6.1 ; also sheet 1,2,3
Unconnected: U11.8(B:!Q) U27.5(A>B_O) U27.7(A<B_O) U39.5(A>B_O) U39.7(A<B_O) U40.5(A>B_O) U40.7(A<B_O) U45.6(A:!Q) U45.8(B:!Q)

### Notes on the sheet
- RIOT does CDF
- DF == old DF?
- CDF Detection and Skip

## Power pins joined to a net without a drawn wire
GND: U1.7(P:GND) U2.1(P:GND) U3.1(P:GND) U4.1(P:GND) U5.1(P:GND) U6.7(P:GND) U7.1(GND) U8.7(P:GND) U9.1(P:GND) U10.7(P:GND) U11.7(P:GND) U12.8(GND) U13.1(P:GND) U14.7(P:GND) U15.7(P:GND) U16.1(P:GND) U17.8(GND) U18.1(P:GND) U20.7(P:GND) U21.7(P:GND) U22.1(P:GND) U23.8(GND) U24.1(P:GND) U25.7(P:GND) U26.7(P:GND) U27.8(GND) U28.1(P:GND) U29.7(P:GND) U30.7(P:GND) U31.7(P:GND) U32.7(P:GND) U33.8(GND) U34.1(P:GND) U35.8(GND) U36.8(GND) U37.1(P:GND) U38.8(GND) U39.8(GND) U40.8(GND) U41.7(P:GND) U42.7(P:GND) U43.7(P:GND) U44.7(P:GND) U45.7(P:GND)
VCC: U1.14(P:VCC) U2.8(P:VCC) U3.8(P:VCC) U4.8(P:VCC) U5.8(P:VCC) U6.14(P:VCC) U7.8(VCC) U8.14(P:VCC) U9.8(P:VCC) U10.14(P:VCC) U11.14(P:VCC) U12.16(VCC) U13.8(P:VCC) U14.14(P:VCC) U15.14(P:VCC) U16.8(P:VCC) U17.16(VCC) U18.8(P:VCC) U20.14(P:VCC) U21.14(P:VCC) U22.8(P:VCC) U23.16(VCC) U24.8(P:VCC) U25.14(P:VCC) U26.14(P:VCC) U27.16(VCC) U28.8(P:VCC) U29.14(P:VCC) U30.14(P:VCC) U31.14(P:VCC) U32.14(P:VCC) U33.16(VCC) U34.8(P:VCC) U35.16(VCC) U36.16(VCC) U37.8(P:VCC) U38.16(VCC) U39.16(VCC) U40.16(VCC) U41.14(P:VCC) U42.14(P:VCC) U43.14(P:VCC) U44.14(P:VCC) U45.14(P:VCC)

## Library data of the parts
BB1-BB8 = dec-con:BUSBAR: Through hole bus bar
C1-C29 = rcl:C-US: CAPACITOR, American symbol
C46-C48 = dec-con:CPOL-USE20-8AXIAL: A 0.8 inch electrolytic.
EDGE = dec-con:QUAD: Quad-Height DEC board
R1-R10 = rcl:R-US_: RESISTOR, American symbol
U1 U21 = 74xx-us:74*00: Quad 2-input NAND gate
U2-U5 U9 U13 U16 U18 U22 U24 U28 U34 U37 = dec-con:SP380: Quad NOR gate (use 8640)
U6 U8 U10 U15 U25 U29 U32 U41 U44 = dec-con:74*38: Quad 2-input NAND gate, open collector output
U7 = dec-con:SP314: 7-Input NOR gate
U11 U26 U45 = 74xx-us:74*74: Dual D type positive edge triggered FLIP FLOP, preset and clear
U12 U17 U23 U36 U38 = 74xx-us:74*174: Hex D type FLIP FLOP, clear
U14 U43 = 74xx-us:74*08: Quad 2-input AND gate
U20 U31 U42 = 74xx-us:74*04: Hex INVERTER
U27 U39 U40 = 74xx-us:74*85: 4-bit magnitude COMPARATOR
U30 = 74xx-us:74*10: Triple 3-input NAND gate
U33 = 74xx-us:74*42: 4-line to 10-line DECODER (1-of-10)
U35 = 74xx-us:74*157: Quadruple 2-line to 1-line data SELECTOR/MULTIPLEXER
U$1 = dec-con:OUTLINE-*: Board outlines for DEC boards.